# EAGLE schematic OzarkPinnacle (EAGLE 9.6.2)
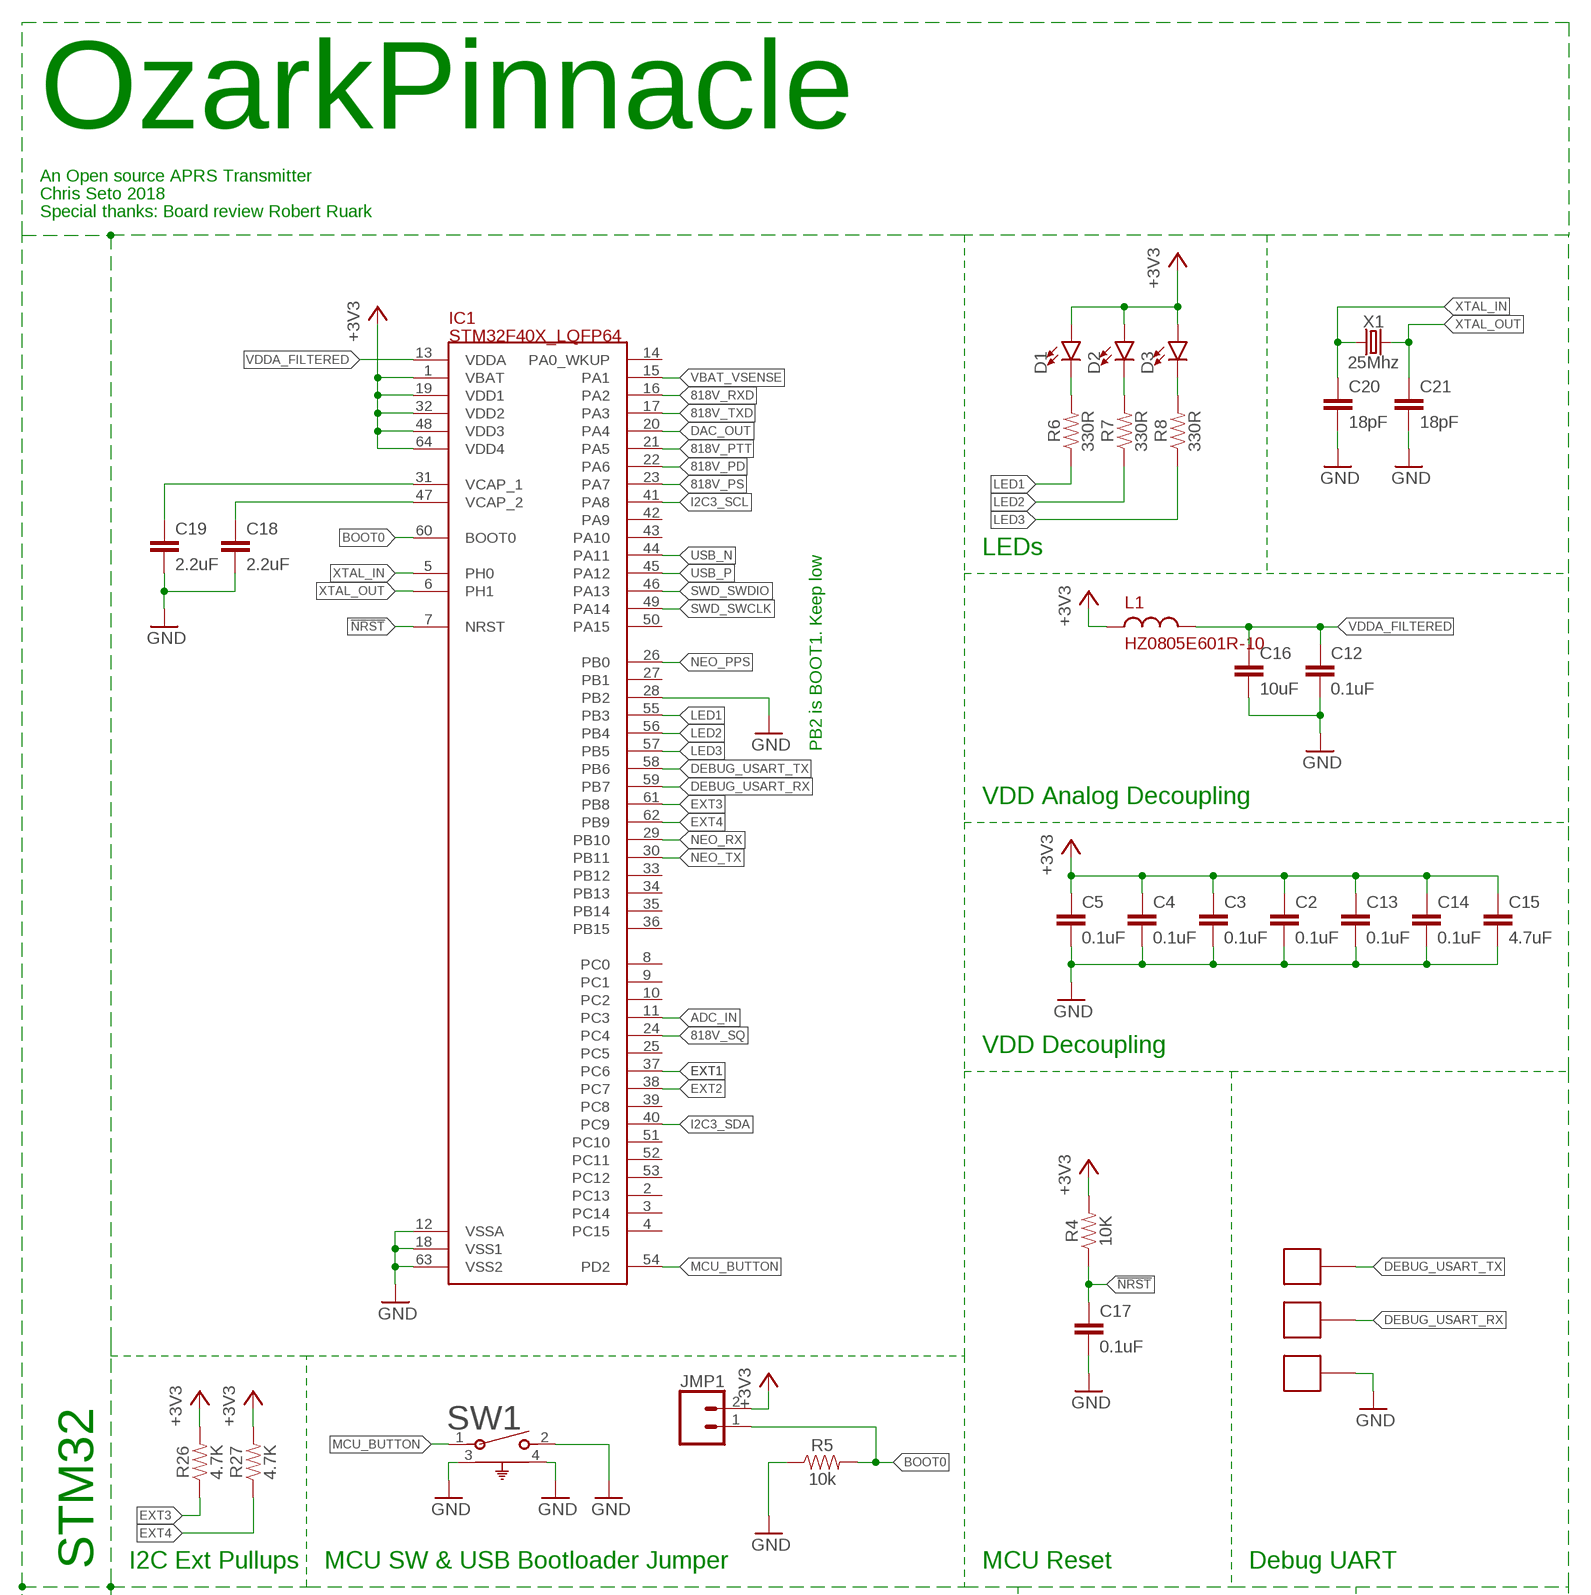
[diagram p0: schematic, sheet 1, part 1 of 2]
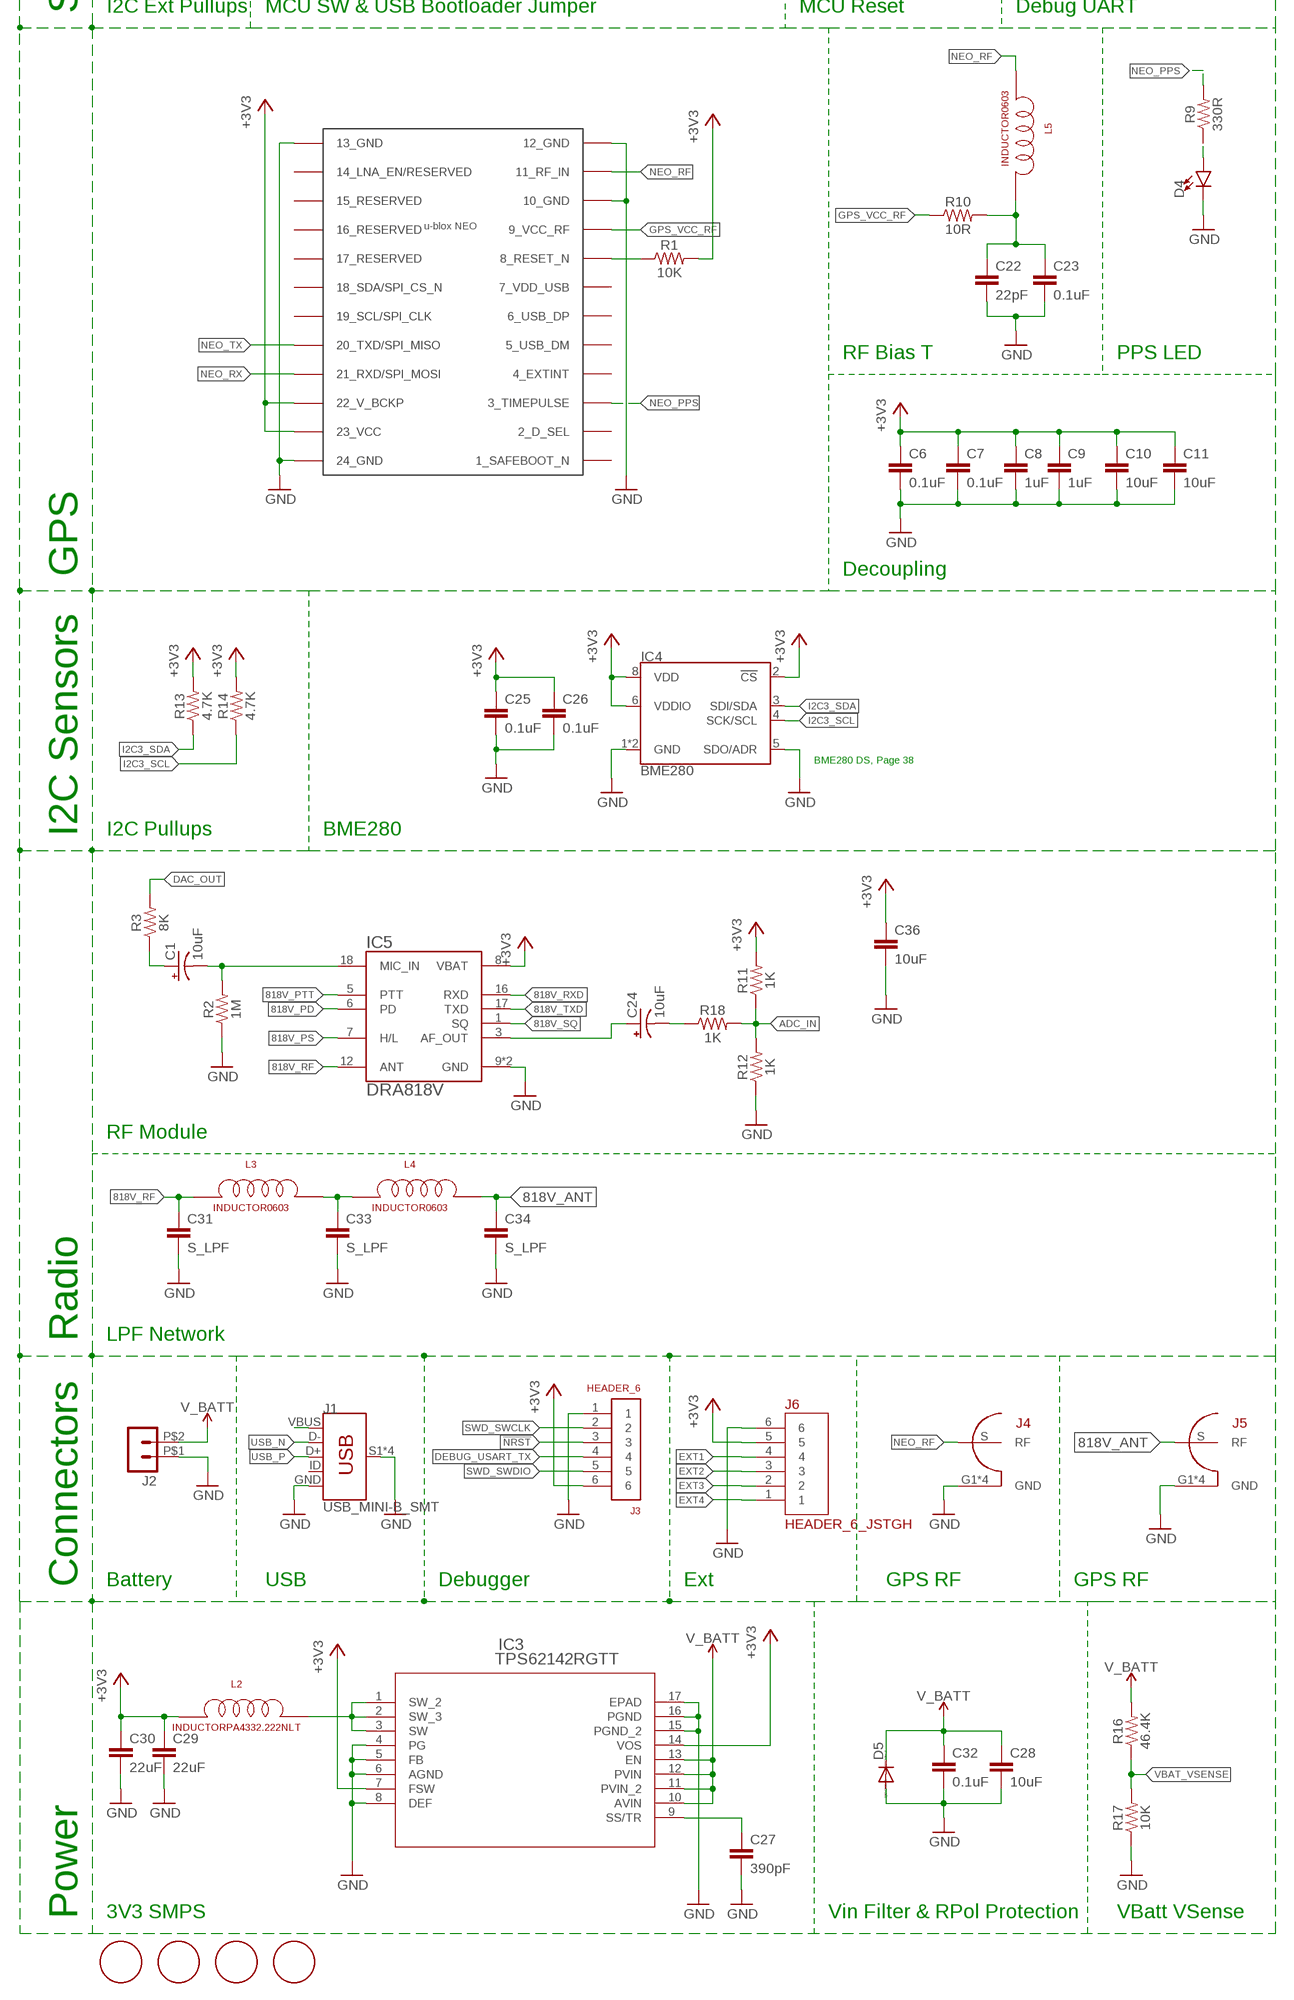
[diagram p1: schematic, sheet 1, part 2 of 2]

## Parts
C1  10uF  CAP_POL1206_POL  [1206]
C2  0.1uF  CAP0603  [0603]
C3  0.1uF  CAP0603  [0603]
C4  0.1uF  CAP0603  [0603]
C5  0.1uF  CAP0603  [0603]
C6  0.1uF  CAP0603  [0603]
C7  0.1uF  CAP0603  [0603]
C8  1uF  C-EUC0805  [C0805]
C9  1uF  C-EUC0805  [C0805]
C10  10uF  C-EUC0805  [C0805]
C11  10uF  C-EUC0805  [C0805]
C12  0.1uF  CAP0603  [0603]
C13  0.1uF  CAP0603  [0603]
C14  0.1uF  CAP0603  [0603]
C15  4.7uF  C-EUC0805  [C0805]
C16  10uF  C-EUC0805  [C0805]
C17  0.1uF  CAP0603  [0603]
C18  2.2uF  C-EUC0805  [C0805]
C19  2.2uF  C-EUC0805  [C0805]
C20  18pF  CAP0603  [0603]
C21  18pF  CAP0603  [0603]
C22  22pF  CAP0603  [0603]
C23  0.1uF  CAP0603  [0603]
C24  10uF  CAP_POL1206_POL  [1206]
C25  0.1uF  CAP0603  [0603]
C26  0.1uF  CAP0603  [0603]
C27  390pF  CAP0603  [0603]
C28  10uF  C-EUC0805  [C0805]
C29  22uF  CAP1210  [1210]
C30  22uF  CAP1210  [1210]
C31  S_LPF  CAP0603  [0603]
C32  0.1uF  CAP0603  [0603]
C33  S_LPF  CAP0603  [0603]
C34  S_LPF  CAP0603  [0603]
C36  10uF  C-EUC0805  [C0805]
D1  LED0603  [LED-0603]
D2  LED0603  [LED-0603]
D3  LED0603  [LED-0603]
D4  LED0603  [LED-0603]
D5  DIODE-DO214AC  [DO214AC]
IC1  STM32F40X_LQFP64  [STM32_LQFP64]
IC2  NEO-M8  [NEO-M8]
IC3  TPS62142RGTT  [RGT16_1P7X1P7]
IC4  BME280  [LGA-8-2.5X2.5]
IC5  DRA818V  [DORJI_DRA818V]
J1  USB_MINI-B_SMT  [USB-MINIB]
J2  HEADER_POS2_43650-0200  [43650-0200]
J3  HEADER_6  [6X2_SMT]
J4  FSK_RUARK2_SMA_0732511150  [FSK_RUARK2_WIDE_SMA]
J5  FSK_RUARK2_SMA_0732511150  [FSK_RUARK2_WIDE_SMA]
J6  HEADER_6_JSTGH  [BM06B-GHS-TBT(LF)(SN)(N)]
JMP1  CONN_02  [1X02]
L1  HZ0805E601R-10  [R0805]
L2  INDUCTORPA4332.222NLT  [PA4332.222NLT]
L3  INDUCTOR0603  [0603]
L4  INDUCTOR0603  [0603]
L5  INDUCTOR0603  [0603]
R1  10K  RESISTOR0603  [0603]
R2  1M  RESISTOR0603  [0603]
R3  8K  RESISTOR0603  [0603]
R4  10K  RESISTOR0603  [0603]
R5  10k  RESISTOR0603  [0603]
R6  330R  RESISTOR0603  [0603]
R7  330R  RESISTOR0603  [0603]
R8  330R  RESISTOR0603  [0603]
R9  330R  RESISTOR0603  [0603]
R10  10R  RESISTOR0603  [0603]
R11  1K  RESISTOR0603  [0603]
R12  1K  RESISTOR0603  [0603]
R13  4.7K  RESISTOR0603  [0603]
R14  4.7K  RESISTOR0603  [0603]
R16  46.4K  RESISTOR0603  [0603]
R17  10K  RESISTOR0603  [0603]
R18  1K  RESISTOR0603  [0603]
R26  4.7K  RESISTOR0603  [0603]
R27  4.7K  RESISTOR0603  [0603]
SW1  1825027-8  [SW2_1825027-C]
U$2  SINGLEPADMIDPAD  [MIDPAD]
U$3  SINGLEPADMIDPAD  [MIDPAD]
U$4  SINGLEPADMIDPAD  [MIDPAD]
U$7  MOUNTING_HOLE#2  [#2_CLEARANCE_HOLE]
U$8  MOUNTING_HOLE#2  [#2_CLEARANCE_HOLE]
U$9  MOUNTING_HOLE#2  [#2_CLEARANCE_HOLE]
U$10  MOUNTING_HOLE#2  [#2_CLEARANCE_HOLE]
X1  25Mhz  CRYSTALSMD-3.2X2.5  [CRYSTAL-SMD-3.2X2.5MM]

## Nets
818V_ANT: C34.1 J5.S(RF) L4.2
818V_PD: IC1.22(PA6) IC5.6(PD)
818V_PS: IC1.23(PA7) IC5.7(H/L)
818V_PTT: IC1.21(PA5) IC5.5(PTT)
818V_RF: C31.1 IC5.12(ANT) L3.1
818V_RXD: IC1.16(PA2) IC5.16(RXD)
818V_SQ: IC1.24(PC4) IC5.1(SQ)
818V_TXD: IC1.17(PA3) IC5.17(TXD)
!NRST: C17.1 IC1.7(NRST) J3.3 R4.1
+3V3: C2.1 C3.1 C4.1 C5.1 C6.1 C7.1 C8.1 C9.1 C10.1 C11.1 C13.1 C14.1 C15.1 C25.1 C26.1 C29.1 C30.1 C36.1 D1.A D2.A D3.A IC1.1(VBAT) IC1.19(VDD1) IC1.32(VDD2) IC1.48(VDD3) IC1.64(VDD4) IC2.22(22_V_BCKP) IC2.23(23_VCC) IC3.7(FSW) IC3.14(VOS) IC4.2(!CS) IC4.6(VDDIO) IC4.8(VDD) IC5.8(VBAT) J3.6 J6.5 JMP1.2 L1.1 L2.1 R1.2 R4.2 R11.2 R13.2 R14.2 R26.2 R27.2
ADC_IN: IC1.11(PC3) R11.1 R12.2 R18.2
BOOT0: IC1.60(BOOT0) JMP1.1 R5.2
DAC_OUT: IC1.20(PA4) R3.2
DEBUG_USART_RX: IC1.59(PB7) U$3.1
DEBUG_USART_TX: IC1.58(PB6) J3.4 U$2.1
EXT1: IC1.37(PC6) J6.4
EXT2: IC1.38(PC7) J6.3
EXT3: IC1.61(PB8) J6.2 R26.1
EXT4: IC1.62(PB9) J6.1 R27.1
GND: C2.2 C3.2 C4.2 C5.2 C6.2 C7.2 C8.2 C9.2 C10.2 C11.2 C12.2 C13.2 C14.2 C15.2 C16.2 C17.2 C18.2 C19.2 C20.2 C21.2 C22.2 C23.2 C25.2 C26.2 C27.2 C28.2 C29.2 C30.2 C31.2 C32.2 C33.2 C34.2 C36.2 D4.C D5.A IC1.12(VSSA) IC1.18(VSS1) IC1.28(PB2) IC1.63(VSS2) IC2.10(10_GND) IC2.12(12_GND) IC2.13(13_GND) IC2.24(24_GND) IC3.4(PG) IC3.5(FB) IC3.6(AGND) IC3.8(DEF) IC3.15(PGND_2) IC3.16(PGND) IC3.17(EPAD) IC4.1(GND) IC4.5(SDO/ADR) IC4.7(GND) IC5.9(GND) IC5.10(GND) J1.GND J1.S1(SHIELD) J1.S2(SHIELD) J1.S3(SHIELD) J1.S4(SHIELD) J2.P$1 J3.1 J4.G1(GND) J4.G2(GND) J4.G3(GND) J4.G4(GND) J5.G1(GND) J5.G2(GND) J5.G3(GND) J5.G4(GND) J6.6 R2.1 R5.1 R12.1 R17.1 SW1.2 SW1.3 SW1.4 U$4.1
GPS_VCC_RF: IC2.9(9_VCC_RF) R10.1
I2C3_SCL: IC1.41(PA8) IC4.4(SCK/SCL) R14.1
I2C3_SDA: IC1.40(PC9) IC4.3(SDI/SDA) R13.1
LED1: IC1.55(PB3) R6.1
LED2: IC1.56(PB4) R7.1
LED3: IC1.57(PB5) R8.1
MCU_BUTTON: IC1.54(PD2) SW1.1
N$2: C19.1 IC1.31(VCAP_1)
N$3: C18.1 IC1.47(VCAP_2)
N$4: IC2.8(8_RESET_N) R1.1
N$5: D2.C R7.2
N$7: D3.C R8.2
N$8: D1.C R6.2
N$9: C22.1 C23.1 L5.2 R10.2
N$10: D4.A R9.1
N$11: C1.1(+) R3.1
N$12: C24.2(-) R18.1
N$14: C1.2(-) IC5.18(MIC_IN) R2.2
N$15: C33.1 L3.2 L4.1
N$17: IC3.1(SW_2) IC3.2(SW_3) IC3.3(SW) L2.2
N$18: C24.1(+) IC5.3(AF_OUT)
N$19: J1.VBUS
N$21: C27.1 IC3.9(SS/TR)
NEO_PPS: IC1.26(PB0) IC2.3(3_TIMEPULSE) R9.2
NEO_RF: IC2.11(11_RF_IN) J4.S(RF) L5.1
NEO_RX: IC1.29(PB10) IC2.21(21_RXD/SPI_MOSI)
NEO_TX: IC1.30(PB11) IC2.20(20_TXD/SPI_MISO)
SWD_SWCLK: IC1.49(PA14) J3.2
SWD_SWDIO: IC1.46(PA13) J3.5
USB_N: IC1.44(PA11) J1.D-
USB_P: IC1.45(PA12) J1.D+
V_BATT: C28.1 C32.1 D5.C IC3.10(AVIN) IC3.11(PVIN_2) IC3.12(PVIN) IC3.13(EN) J2.P$2 R16.2
VBAT_VSENSE: IC1.15(PA1) R16.1 R17.2
VDDA_FILTERED: C12.1 C16.1 IC1.13(VDDA) L1.2
XTAL_IN: C20.1 IC1.5(PH0) X1.1
XTAL_OUT: C21.1 IC1.6(PH1) X1.3
Unconnected: IC1.2(PC13) IC1.3(PC14) IC1.4(PC15) IC1.8(PC0) IC1.9(PC1) IC1.10(PC2) IC1.14(PA0_WKUP) IC1.25(PC5) IC1.27(PB1) IC1.33(PB12) IC1.34(PB13) IC1.35(PB14) IC1.36(PB15) IC1.39(PC8) IC1.42(PA9) IC1.43(PA10) IC1.50(PA15) IC1.51(PC10) IC1.52(PC11) IC1.53(PC12) IC2.1(1_SAFEBOOT_N) IC2.2(2_D_SEL) IC2.4(4_EXTINT) IC2.5(5_USB_DM) IC2.6(6_USB_DP) IC2.7(7_VDD_USB) IC2.14(14_LNA_EN/RESERVED) IC2.15(15_RESERVED) IC2.16(16_RESERVED) IC2.17(17_RESERVED) IC2.18(18_SDA/SPI_CS_N) IC2.19(19_SCL/SPI_CLK) J1.ID

## Notes on the sheet
- OzarkPinnacle
- An Open source APRS Transmitter
- Chris Seto 2018
- Special thanks: Board review Robert Ruark
- LEDs
- PB2 is BOOT1. Keep low
- VDD Analog Decoupling
- VDD Decoupling
- STM32 | I2C Ext Pullups | MCU SW & USB Bootloader Jumper | MCU Reset | Debug UART
- RF Bias T | PPS LED
- GPS | Decoupling
- BME280 DS, Page 38
- I2C Sensors | I2C Pullups | BME280
- RF Module
- Radio | LPF Network
- Connectors | Battery | USB | Debugger | Ext | GPS RF | GPS RF
- Power | 3V3 SMPS | Vin Filter & RPol Protection | VBatt VSense

## Library data of the parts
C1 C24 = HappyMedium:CAP_POL
C2-C7 C12-C14 C17 C20-C23 C25-C27 C29-C34 = HappyMedium:CAP
C8-C11 C15 C16 C18 C19 C28 C36 = resistor:C-EU: CAPACITOR, European symbol
D1-D4 = SparkFun-LED:LED: LED (Generic) Standard schematic elements and footprints for 5mm, 3mm, 1206, and 0603 sized LEDs. Generic LEDs with no color specified.
D5 = diode:DIODE-: DIODE
IC1 = HappyMedium:STM32F40X_LQFP64
IC2 = ubloxLib:NEO-M8: u-blox NEO GNSS module
IC3 = TPS62142RGTT:TPS62142RGTT; MANUFACTURER_PART_NUMBER: TPS62142RGTT; VENDOR: Texas Instruments
IC4 = SparkFun-Sensors:BME280: Bosch BME280 – Combined Humidity and Pressure Sensor The BME280 is as combined digital humidity, pressure and temperature sensor based on proven sensing principles. The sensor module is housed in an extremely compact metal-lid LGA package with a footprint of only 2.5×2.5mm² with a height of 0.93mm. Its small dimensions and its low power consumption allow the implementation in battery driven devices such as handsets, GPS modules or watches. Datasheet <https://cdn.sparkfun.com/assets/learn_tutorials/4/1/9/BST-BME280_DS001-10.pdf> SparkFun Products SparkFun Atmospheric Sensor Breakout - BME280 <https://www.sparkfun.com/products/13676> (SEN-13676); PROD_ID: IC-13090
IC5 = DRA818V:DRA818V: VHF Band Voice Transceiver Module; AVAILABILITY: Unavailable; MF: DORJI; MP: DRA818V; PACKAGE: Package Analog Devices; PRICE: None
J1 = SparkFun-Connectors:USB_MINI-B: USB type Mini-B Connector Breaks out 5th pin, and includes shield pins if needed. SparkFun Products: SparkFun FTDI Basic Breakout <https://www.sparkfun.com/products/9716> SparkFun XBee Explorer USB <https://www.sparkfun.com/products/11812> SparkFun Redboard <https://www.sparkfun.com/products/12757>; PROD_ID: CONN-08193; SF_ID: PRT-00587
J2 = con-molex-micro-fit-3_0:HEADER_POS2_?: Molex - Micro-Fit 3.0 Series connector, 3.00mm (0.118") pitch header, 2 positions.
J3 = HappyMedium:HEADER_6
J4 J5 = UsbBoard:FSK_RUARK2_SMA_0732511150
J6 = HappyMedium:HEADER_6_
JMP1 = SparkFun-Connectors:CONN_02: Multi connection point. Often used as Generic Header-pin footprint for 0.1 inch spaced/style header connections On any of the 0.1 inch spaced packages, you can populate with these: Break Away Headers - Straight <https://www.sparkfun.com/products/116> (PRT-00116) Break Away Male Headers - Right Angle <https://www.sparkfun.com/products/553> (PRT-00553) Female Headers <https://www.sparkfun.com/products/115> (PRT-00115) Break Away Headers - Machine Pin <https://www.sparkfun.com/products/117> (PRT-00117) Break Away Female Headers - Swiss Machine Pin <https://www.sparkfun.com/products/743> (PRT-00743) For SCREWTERMINALS and SPRING TERMINALS visit here: Screw Terimnals on SparkFun.com <https://www.sparkfun.com/search/results?term=Screw+Terminals> (5mm/3.5mm/2.54mm spacing) This device is also useful as a general connection point to wire up your design to another part of your project. Our various solder wires solder well into these plated through hole pads. Hook-Up Wire - Assortment (Stranded, 22 AWG) <https://www.sparkfun.com/products/11375> (PRT-11375) Hook-Up Wire - Assortment (Solid Core, 22 AWG) <https://www.sparkfun.com/products/11367> (PRT-11367) View the entire wire category on our website here <https://www.sparkfun.com/categories/141> Special notes: Molex polarized connector foot print use with: PRT-08233 with associated crimp pins and housings. 2.54_SCREWTERM for use with PRT-10571. 3.5mm Screw Terminal footprints for PRT-08084 5mm Screw Terminal footprints for use with PRT-08432
L1 = HappyMedium:HZ0805E601R-10
L2-L5 = HappyMedium:INDUCTOR
R1-R14 R16-R18 R26 R27 = SparkFun-Resistors:RESISTOR: Generic Resistor Package
SW1 = button:1825027-8; MANUFACTURER_PART_NUMBER: 18250278; VENDOR: TE Connectivity
U$2-U$4 = HappyMedium:SINGLEPAD
U$7-U$10 = HappyMedium:MOUNTING_HOLE
X1 = SparkFun-Clocks:CRYSTAL: Crystals (Generic) These are passive quartz crystals, which can be used as a clock source for a microcontroller. Crystal's are two-terminal devices. They require external "load" capacitors to generate an oscillating signal.